# EasyEDA Pro project PCB.epro

# Board BaseBoard
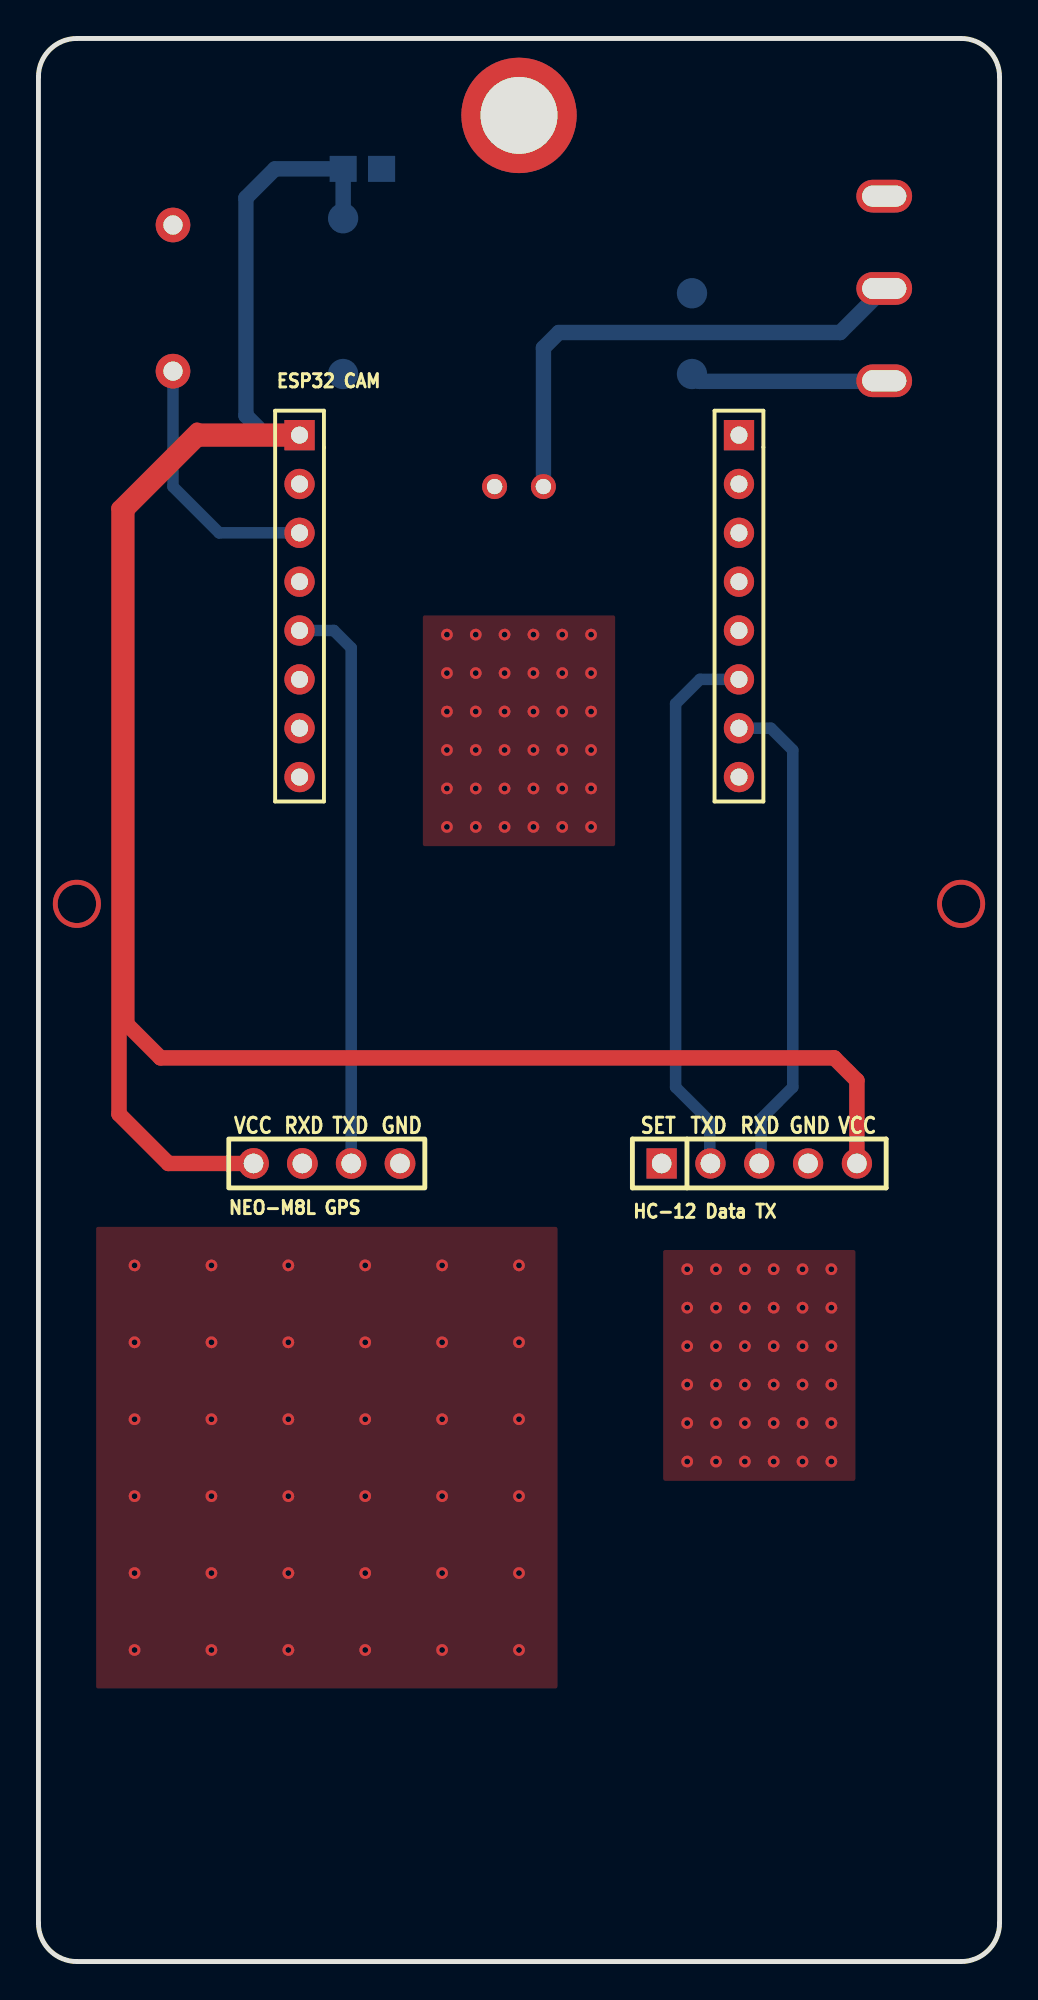
[diagram p0: board, top side]
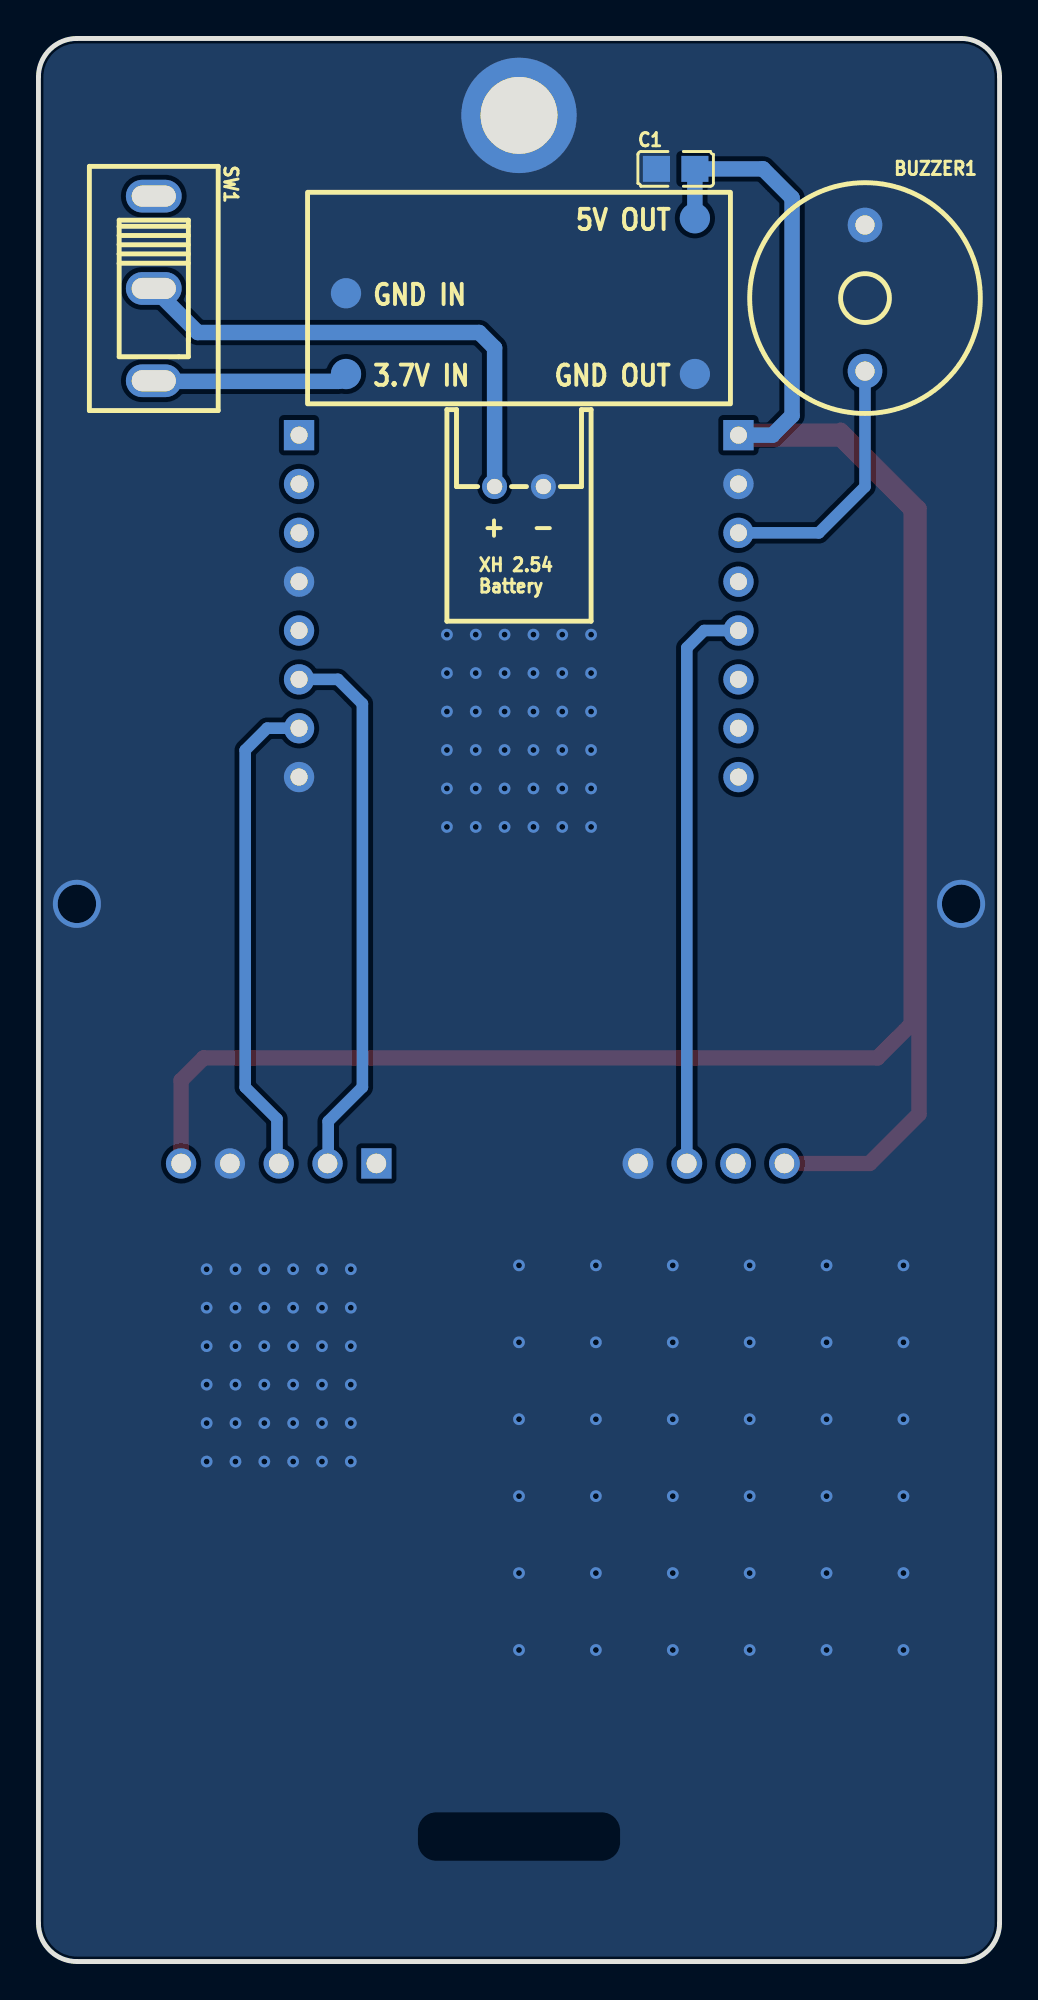
[diagram p1: board, bottom side, seen from below]

Outline 50 x 100 mm; copper layers: Top Layer, Bottom Layer. Coordinates in mm from the lower left corner of the outline.
Outline path: 0,98 0,2 arc(0.59,0.59) 2,0 48,0 arc(49.41,0.59) 50,2 50,98 arc(49.41,99.41) 48,100 2,100 arc(0.59,99.41) 0,98
Stack: Top Layer 0.035mm / Dielectric1 1.51mm FR4 er 4.5 / Bottom Layer 0.035mm

## Design rules (mm)
template: 自定义配置
spacing copperThickness1oz (default): track to track 0.102, other pairs 0.152 to 0.3
spacing copperThickness2oz: track to track 0.203, other pairs 0.152 to 0.3
track width copperThickness1oz (default): min 0.127, default 0.254, max 2.54
track width copperThickness2oz: min 0.203, default 0.254, max 2.54
differential pair differentialPair (default): width min 0.127, default 0.254, max 2.54; gap min 0.152, default 0.152
via viaSize (default): diameter min 0.5, default 0.61, max 10; hole min 0.3, default 0.305, max 6.3
net GND uses copperThickness2oz
net 3.7V uses copperThickness2oz
net 5.0V uses copperThickness2oz
net GPSTX uses copperThickness2oz
net HCTX uses copperThickness2oz
net HTRX uses copperThickness2oz
net BUZZ+ uses copperThickness2oz

## Placement (name value [footprint] x y rotation side)
BUZZER1  -  [BUZ-TH_BD12.0-P7.60-D0.6-FD]  7 86.5 90 bottom
C1  -  [C0805]  16.85 93.22 180 bottom
ESP32 CAM  -  [ESP32-CAM]  11.5 97 0 top
HC-12 Data TX  -  [HDR-TH_5P-P2.54-V-F]  37.5 41.5 0 top
NEO-M8L GPS  -  [HDR-TH_4P-P2.54-V-F_4]  15 41.5 0 top
NOREF  -  [Pad_e14]  25 96 0 top
NOREF#2  -  [Pad_e294]  34 86.75 90 top
NOREF#3  -  [Pad_e297]  15.85 90.65 90 top
NOREF#4  -  [Pad_e295]  34 82.55 90 top
NOREF#5  -  [Pad_e296]  15.85 82.55 90 top
SW1  -  [SW-TH_SHOU-HAN_SS12D10G4]  44 87 270 bottom
XH 2.54
Battery  -  [CONN-TH_2P-P2.54_WZ-D]  25 76.7 180 bottom

## Footprints (pads in the part's own frame, mm; a bottom-side part is the same pattern mirrored in y, then rotated)
BUZ-TH_BD12.0-P7.60-D0.6-FD
  round 1.8 hole 1: 1(-3.8,0) 2(3.8,0)
C0805
  rect 1.41x1.35 smd: 1(-1,0) 2(1,0)
CONN-TH_2P-P2.54_WZ-D
  round 1.3 hole 0.8: 1(-1.27,0) 2(1.27,0)
ESP32-CAM
  rect 1.575x1.575 hole 0.889: 1(2.083,-17.628) 16(24.943,-17.628)
  round 1.575 hole 0.889: 2(2.083,-20.168) 3(2.083,-22.707) 4(2.083,-25.247) 5(2.083,-27.788) 6(2.083,-30.328) 7(2.083,-32.867) 8(2.083,-35.407) 9(24.943,-35.407) 10(24.943,-32.867) 11(24.943,-30.328) 12(24.943,-27.788) 13(24.943,-25.247) 14(24.943,-22.707) 15(24.943,-20.168)
HDR-TH_4P-P2.54-V-F_4
  round 1.6 hole 1.02: 1(-3.81,0) 2(-1.27,0) 3(1.27,0) 4(3.81,0)
HDR-TH_5P-P2.54-V-F
  rect 1.575x1.575 hole 1.02: 1(-5.08,0)
  round 1.575 hole 1.02: 2(-2.54,0) 3(0,0) 4(2.54,0) 5(5.08,0)
Pad_e14
  round 6 hole 4: 1(0,0)
Pad_e294
  round 1.575 smd far side: 1(0,0)
Pad_e295
  round 1.575 smd far side: 2(0,0)
Pad_e296
  round 1.575 smd far side: 3(0,0)
Pad_e297
  round 1.575 smd far side: 4(0,0)
SW-TH_SHOU-HAN_SS12D10G4
  oval 1.7x2.9 hole 1.1x2.3: 1(-4.8,0) 2(0,0) 3(4.8,0)

## Nets
3.7V: NOREF#4.2 SW1.3
5.0V: C1.2 ESP32 CAM.1 HC-12 Data TX.5 NEO-M8L GPS.1 NOREF#3.4
GND: BUZZER1.2 C1.1 ESP32 CAM.2 ESP32 CAM.9 ESP32 CAM.13 HC-12 Data TX.4 NEO-M8L GPS.4 NOREF.1 NOREF#2.1 NOREF#5.3 XH 2.54
Battery.2
BAT-3.7V: SW1.2 XH 2.54
Battery.1
BUZZ+: BUZZER1.1 ESP32 CAM.3
GPSTX: ESP32 CAM.5 NEO-M8L GPS.3
HCTX: ESP32 CAM.11 HC-12 Data TX.2
HTRX: ESP32 CAM.10 HC-12 Data TX.3

Pads without a net: ESP32 CAM 4 6 7 8 12 14 15 16; HC-12 Data TX 1; NEO-M8L GPS 2; SW1 1

## Via types
v1: diameter 0.61, hole 0.305, Top Layer to Bottom Layer, 108 vias
v2: diameter 2.5, hole 2, Top Layer to Bottom Layer, 2 vias

## Routing (per net, layer and track width the routed paths; a pad name or vN(x,y) marks a point on that pad's centre or on a via; arc(x,y) is an arc through that point)
3.7V: length 10.2
  Bottom Layer w0.8: NOREF#4.2 34.38,82.17 43.97,82.17 SW1.3
5.0V: length 148.9
  Top Layer w0.6: 4.7,48.64 4.7,75.44 8.38,79.12 8.38,79.38
  Top Layer w0.8: NEO-M8L GPS.1 6.76,41.5 4.19,44.07 4.19,75.56 8.25,79.63 ; HC-12 Data TX.5 42.58,45.81 41.4,46.99 6.35,46.99 4.7,48.64
  Top Layer w1.2: ESP32 CAM.1 13.33,79.37 13.33,79.38 8.38,79.38
  Bottom Layer w0.8: ESP32 CAM.1 11.81,79.37 10.79,80.39 10.79,91.71 12.3,93.22 C1.2 NOREF#3.4
GND:
  vias: v1(5,36.2) v1(5,32.2) v1(5,28.2) v1(5,24.2) v1(5,20.2) v1(5,16.2) v1(9,36.2) v1(9,32.2) v1(9,28.2) v1(9,24.2) v1(9,20.2) v1(9,16.2) v1(13,36.2) v1(13,32.2) v1(13,28.2) v1(13,24.2) v1(13,20.2) v1(13,16.2) v1(17,36.2) v1(17,32.2) v1(17,28.2) v1(17,24.2) v1(17,20.2) v1(17,16.2) v1(21,36.2) v1(21,32.2) v1(21,28.2) v1(21,24.2) v1(21,20.2) v1(21,16.2) v1(21.25,69) v1(21.25,67) v1(21.25,65) v1(21.25,63) v1(21.25,61) v1(21.25,59) v1(22.75,69) v1(22.75,67) v1(22.75,65) v1(22.75,63) v1(22.75,61) v1(22.75,59) v1(24.25,69) v1(24.25,67) v1(24.25,65) v1(24.25,63) v1(24.25,61) v1(24.25,59) v1(25,36.2) v1(25,32.2) v1(25,28.2) v1(25,24.2) v1(25,20.2) v1(25,16.2) v1(25.75,69) v1(25.75,67) v1(25.75,65) v1(25.75,63) v1(25.75,61) v1(25.75,59) v1(27.25,69) v1(27.25,67) v1(27.25,65) v1(27.25,63) v1(27.25,61) v1(27.25,59) v1(28.75,69) v1(28.75,67) v1(28.75,65) v1(28.75,63) v1(28.75,61) v1(28.75,59) v1(33.75,36) v1(33.75,34) v1(33.75,32) v1(33.75,30) v1(33.75,28) v1(33.75,26) v1(35.25,36) v1(35.25,34) v1(35.25,32) v1(35.25,30) v1(35.25,28) v1(35.25,26) v1(36.75,36) v1(36.75,34) v1(36.75,32) v1(36.75,30) v1(36.75,28) v1(36.75,26) v1(38.25,36) v1(38.25,34) v1(38.25,32) v1(38.25,30) v1(38.25,28) v1(38.25,26) v1(39.75,36) v1(39.75,34) v1(39.75,32) v1(39.75,30) v1(39.75,28) v1(39.75,26) v1(41.25,36) v1(41.25,34) v1(41.25,32) v1(41.25,30) v1(41.25,28) v1(41.25,26) v2(2,55) v2(48,55)
BAT-3.7V: length 26.2
  Bottom Layer w0.8: XH 2.54
Battery.1 26.27,83.91 27.07,84.71 41.71,84.71 SW1.2
BUZZ+: length 13.6
  Bottom Layer w0.6: BUZZER1.1 7,76.69 9.4,74.29 ESP32 CAM.3
GPSTX: length 29.9
  Bottom Layer w0.6: ESP32 CAM.5 15.37,69.21 16.27,68.31 NEO-M8L GPS.3
HCTX: length 28.5
  Bottom Layer w0.6: ESP32 CAM.11 34.41,66.67 33.15,65.41 33.15,45.47 34.93,43.69 34.93,41.53 HC-12 Data TX.2
HTRX: length 25.5
  Bottom Layer w0.6: HC-12 Data TX.3 37.59,41.59 37.59,43.81 39.24,45.47 39.24,62.99 38.1,64.13 ESP32 CAM.10

## Copper pours and planes (outline as drawn; the poured copper is in the pictures)
GND on Top Layer: 20,70 30,70 30,58 20,58
GND on Top Layer: 32.5,37 42.5,37 42.5,25 32.5,25
GND on Top Layer: 3,38.2 27,38.2 27,14.2 3,14.2
GND on Bottom Layer: 0,98 0.02,98.28 0.08,98.56 0.18,98.83 0.32,99.08 0.49,99.31 0.69,99.51 0.92,99.68 1.17,99.82 1.44,99.92 1.72,99.98 2,100 48,100 48.28,99.98 48.56,99.92 48.83,99.82 49.08,99.68 49.31,99.51 49.51,99.31 49.68,99.08 49.82,98.83 49.92,98.56 49.98,98.28 50,98 50,2 49.98,1.71 49.92,1.44 49.82,1.17 49.68,0.92 49.51,0.69 49.31,0.49 49.08,0.32 48.83,0.18 48.56,0.08 48.28,0.02 48,0 2,0 1.72,0.02 1.44,0.08 1.17,0.18 0.92,0.32 0.69,0.49 0.49,0.69 0.32,0.92 0.18,1.17 0.08,1.44 0.02,1.71 0,2

## Text on the board
Bottom Silkscreen Layer: GND IN | 3.7V IN | - | + | 5V OUT | GND OUT
Top Silkscreen Layer: VCC | RXD | TXD | GND | SET
